# Altium schematic sheet powerPCB9-2.SchDoc
size A
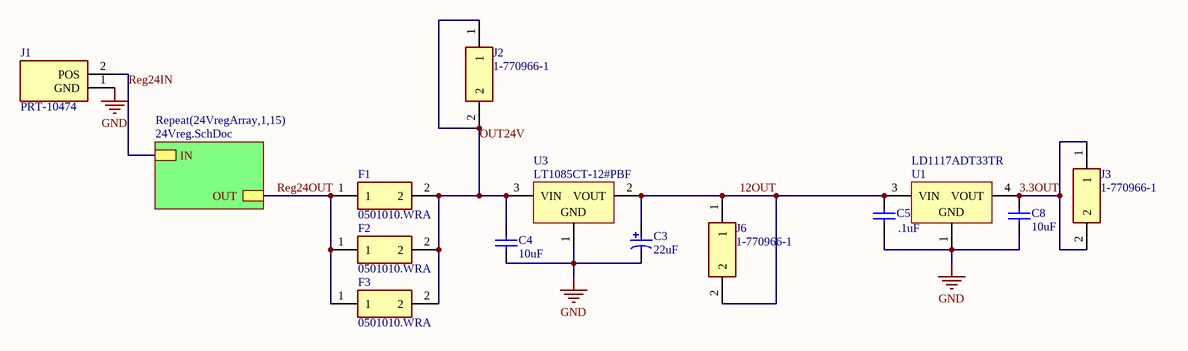
[diagram p0: powerPCB9-2.SchDoc]

## Parts
C3  22uF  [KEMT-D-7343-31-2_L]
C4  10uF  [CAPC2013X135X45ML10T25]
C5  .1uF  [CAPC2013X135X45ML10T25]
C8  10uF  [CAPC2013X135X45ML10T25]
F1  0501010.WRA  [FUSC3216X98N]
F2  0501010.WRA  [FUSC3216X98N]
F3  0501010.WRA  [FUSC3216X98N]
J1  PRT-10474  [SHDR2W320P716_1X2_1574X813X1588P]
J2  1-770966-1  [17709661]
J3  1-770966-1  [17709661]
J6  1-770966-1  [17709661]
U1  LD1117ADT33TR  [TO-252_L]
U3  LT1085CT-12#PBF  [LT-T-3]

## Sub-sheets
Repeat(24VregArray,1,15) = 24Vreg.SchDoc: OUT, IN

## Nets
GND: C3.2 C4.1 C5.1 C8.1 J1.1(GND) U1.1(GND) U3.1(GND)
3.3OUT: C8.2 J3.1 J3.2 U1.4(VOUT)
12OUT: C3.1 C5.2 J6.1 J6.2 U1.3(VIN) U3.2(VOUT)
OUT24V: C4.2 F1.2 F2.2 F3.2 J2.1 J2.2 U3.3(VIN)
Reg24IN: J1.2(POS) ; sheet Repeat(24VregArray,1,15)/IN
Reg24OUT: F1.1 F2.1 F3.1 ; sheet Repeat(24VregArray,1,15)/OUT

## Library data of the parts
C3 = CMP-2000-07210-1: Capacitor, Tantalum, 22 uF, +/- 10%, 35 V, -55 to 125 degC, 2-Pin Molded, RoHS, Tape and Reel; Manufacturer: Kemet; Seal: NotRequired; Voltage: 35VDC; Product Diameter (mm): NotRequiredmm; DCL: 7.7uA; ESR: 0.3ohm; Product Depth (mm): 4.3mm; Polarity: Polar; Capacitance: 22000000pF; DF: 6%; Product Height (mm): 2.8mm; Product Length (mm): 7.3mm; Rad Hardened: No; Mounting Technology: SurfaceMount; Packaging: TapeandReel; Case Code: D; Datasheet URL: https://datasheet.ciiva.com/28561/1780647-28561674.pdf; Case Style: Molded; Datasheet Version: 12/2013; Length W/Weld: NotRequiredmm; Insulation: NotRequired; Construction: SMTChip; Operating Temp Range: -55Cto125C; Lead Spacing (nom): NotRequiredmm; Package Description: 2-Pin Surface Mount Device, Body 7.3 x 4.3 mm, Height 3.1 mm; Package Reference: Molded-2; Wire Form: NotRequired; Length W/Weld (max): NotRequiredmm; Manufacturer URL: http://www.kemet.com/; Mounting Style: SurfaceMount; Tolerance (+ or -): 10%; Seated Plane Height: NotRequiredmm; Failure Rate: NotRequired; Package / Case: 7343-31
C4 C8 = CMP-2007-03541-1: Part Number: GRM21BR61E106KA73L; Manufacturer: Murata
C5 = CMP-2100-03644-1: Chip Capacitor, 0.1 uF, +/- 10%, 50 V, -55 to 125 degC, 0805 (2012 Metric), RoHS, Tape and Reel; Manufacturer: Murata; Voltage: 50V; Capacitance: 100nF; Insulation Resistance: 10GR; Dielectric Material: Ceramic; Dielectric: X7R; Package Description: 2-Pin Surface Mount Device, Body 2 x 1.25 mm; Manufacturer URL: http://www.murata.com/; Case Code (Imperial): 0805; Datasheet URL: http://psearch.en.murata.com/capacitor/product/GRM21BR71H104KA01%23.pdf; Termination: SMD/SMT; Lead Free: LeadFree; Package Quantity: 1; Mount: SurfaceMount; REACH SVHC: Unknown; Thickness: 0.053inch; Height: 1.25mm; Case/Package: 0805; Voltage Rating: 50V; Width: 0.049inch; Case Code (Metric): 2012; Material: Ceramic; Min Operating Temperature: -55degC; RoHSCompliant: true; Datasheet Version: 42675.0; Voltage Rating (DC): 50V; Tolerance: 10%; Package Reference: 0805; Depth: 1.25mm; Length: 2mm; Max Operating Temperature: 125degC; Packaging: TapeandReel; Number of Pins: 2; Radiation Hardening: No
F1-F3 = 0501010.WRA: Fuse; Manufacturer_Name: LITTELFUSE; Datasheet Link: https://www.littelfuse.com/~/media/electronics/datasheets/fuses/littelfuse_fuse_501_datasheet.pdf.pdf; Height: 0.985mm; Manufacturer_Part_Number: 0501010.WRA; Mouser Part Number: 576-0501010.WRA; Mouser Price/Stock: https://www.mouser.com/Search/Refine.aspx?Keyword=576-0501010.WRA
J1 = PRT-10474: Connector; Manufacturer_Name: SparkFun; Datasheet Link: http://cdn.sparkfun.com/datasheets/Prototyping/xt60.pdf; Height: 15.875mm; Manufacturer_Part_Number: PRT-10474; Mouser Part Number: 474-PRT-10474; Mouser Price/Stock: https://www.mouser.com/Search/Refine.aspx?Keyword=474-PRT-10474
J2 J3 J6 = 1-770966-1: Connector; Manufacturer_Name: TE Connectivity; Allied_Number: 70084920; Datasheet Link: https://www.te.com/commerce/DocumentDelivery/DDEController?Action=showdoc&DocId=Customer+Drawing%7F770966%7FG1%7Fpdf%7FEnglish%7FENG_CD_770966_G1.pdf%7F1-770966-1; Height: 7.77mm; Manufacturer_Part_Number: 1-770966-1; Mouser Part Number: 571-1-770966-1; Mouser Price/Stock: https://www.mouser.com/Search/Refine.aspx?Keyword=571-1-770966-1; RS Part Number: 7099906; RS Price/Stock: https://uk.rs-online.com/web/p/products/7099906; Allied Price/Stock: https://www.alliedelec.com/teconnectivity-1-770966-1/70084920/
U1 = CMP-0244-00137-1: 1A, Low Drop Positive Voltage Regulator, 3.3V, 3-Pin DPAK, Tape and Reel; ComponentLink2URL: http://www.st.com/internet/com/TECHNICAL_RESOURCES/TECHNICAL_LITERATURE/DATASHEET/CD00002116.pdf; ComponentLink2Description: Datasheet; ComponentLink1URL: http://www.st.com; PackageDescription: 3-Pin Transistor Outline Package 2.28 mm Pitch, 9.7 mm Lead Span (DPAK); ComponentLink1Description: Manufacturer URL; PackageVersion: 2011; PackageReference: TO-252; DatasheetVersion: 2/12/2011
U3 = CMP-0476-01889-1: 3 A Low Dropout Positive Regulator, 4.3 to 25 V Vin, 12 V Vout, 3-pin FM (T-3), 0 to 150 degC, Pb-Free; Manufacturer: Linear Technology; Discrete Pass Element: no; Iout(mA): 3000; Vin Min(V): 4.3; Vin Max(V): 25; Dropout Voltage(V): 1.3; PSRR(dB): 72; Number of Outputs: 1; Output Voltage: 12 V; Isupply(mA): 5; ComponentLink3URL: http://cds.linear.com/docs/en/packaging/TO-220_3_05-08-1420.pdf; PackageVersion: Jun-10; ComponentLink2Description: Datasheet; Mounting Technology: Through Hole; PackageDescription: 3-Pin Plastic TO-220, Body 10.2235 x 4.3815 mm, Pitch 2.54 mm; ComponentLink1URL: http://www.linear.com/; PartNumber: LT1085CT-12#PBF; RoHS: TRUE; DatasheetVersion: Rev. D; PackageReference: T-3; ComponentLink2URL: http://cds.linear.com/docs/en/datasheet/1083ffd.pdf; ComponentLink3Description: Package Specification; ComponentLink1Description: Manufacturer URL